# EAGLE design CSR8635-V1.3 (EAGLE 7.2.0)
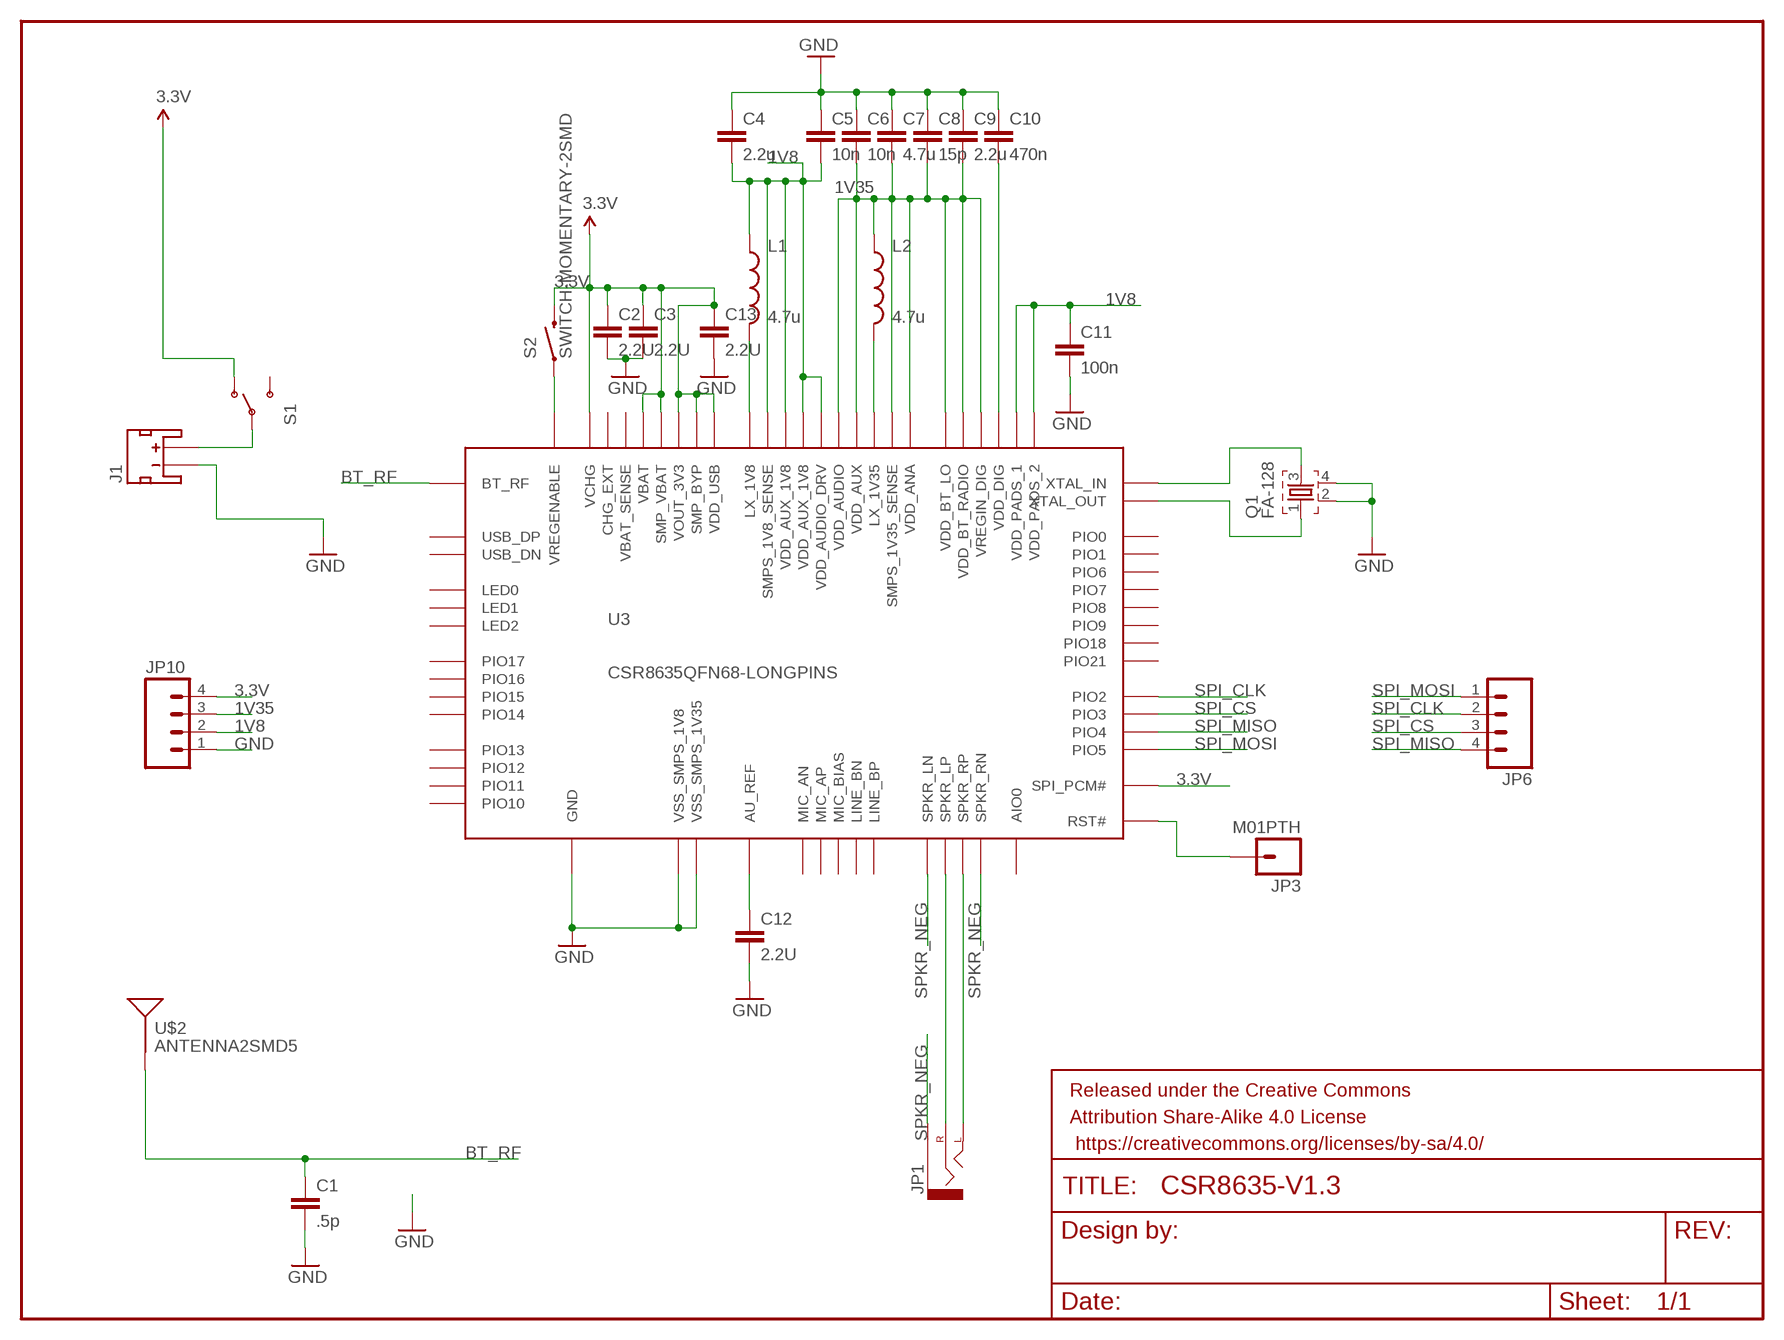
[diagram p0: schematic, sheet 1]

## Parts
C1  .5p  CAP0603-CAP  [0603-CAP]
C2  2.2U  CAP0603-CAP  [0603-CAP]
C3  2.2U  CAP0603-CAP  [0603-CAP]
C4  2.2u  CAP0603-CAP  [0603-CAP]
C5  10n  CAP0603-CAP  [0603-CAP]
C6  10n  CAP0603-CAP  [0603-CAP]
C7  4.7u  CAP0603-CAP  [0603-CAP]
C8  15p  CAP0603-CAP  [0603-CAP]
C9  2.2u  CAP0603-CAP  [0603-CAP]
C10  470n  CAP0603-CAP  [0603-CAP]
C11  100n  CAP0603-CAP  [0603-CAP]
C12  2.2U  CAP0603-CAP  [0603-CAP]
C13  2.2U  CAP0603-CAP  [0603-CAP]
FRAME1  FRAME-LETTER  [CREATIVE_COMMONS]
J1  JST_2MM_MALE  [JST-2-SMD]
JP1  AUDIO-JACKSMD2  [AUDIO-JACK-3.5MM-SMD]
JP3  M01PTH  [1X01]
JP6  M04PTH  [1X04]
JP10  M04PTH  [1X04]
L1  4.7u  INDUCTOR0805  [0805]
L2  4.7u  INDUCTOR0805  [0805]
Q1  FA-128  [FA-128]
S1  SWITCH-SPDTPTH  [SWITCH-SPDT]
S2  SWITCH-MOMENTARY-2SMD  [TACTILE-SWITCH-SMD]
U3  CSR8635QFN68-LONGPINS  [QFN68]
U$2  ANTENNA2SMD5  [ANTENNA-CHIP5]

## Nets
1V8: C4.2 C5.2 C11.1 JP10.2 L1.1 U3.8(VDD_AUDIO_DRV) U3.15(VDD_AUX_1V8) U3.16(VDD_AUX_1V8) U3.33(VDD_PADS_1) U3.53(SMPS_1V8_SENSE) U3.63(VDD_PADS_2)
1V35: C6.2 C7.2 C8.2 C9.2 JP10.3 L2.1 U3.3(VDD_AUDIO) U3.11(VDD_BT_RADIO) U3.13(VDD_BT_LO) U3.14(VDD_AUX) U3.17(VDD_ANA) U3.39(VREGIN_DIG) U3.52(SMPS_1V35_SENSE)
3.3V: C2.1 C3.1 C13.1 JP10.4 S1.1(O) S2.3 U3.29(SPI_PCM#) U3.41(VOUT_3V3) U3.42(VCHG) U3.45(VBAT) U3.48(SMP_VBAT) U3.49(SMP_BYP) U3.54(VDD_USB)
!SPI_PCM: JP3.1 U3.35(RST#)
BT_RF: C1.1 U3.12(BT_RF) U$2.FEED(SIGNAL)
GND: C1.2 C2.2 C3.2 C4.1 C5.1 C6.1 C7.1 C8.1 C9.1 C10.1 C11.2 C12.2 C13.2 J1.1(-) JP10.1 Q1.2 Q1.4 U3.46(VSS_SMPS_1V8) U3.51(VSS_SMPS_1V35) U3.CNTR1(GND) U3.CNTR2(GND) U3.CNTR3(GND) U3.CNTR(GND)
N$1: J1.2(+) S1.2(P)
N$2: JP1.RING(RIGHT) U3.10(SPKR_LP)
N$3: L1.2 U3.47(LX_1V8)
N$4: Q1.3 U3.19(XTAL_IN)
N$5: L2.2 U3.50(LX_1V35)
N$6: C10.2 U3.38(VDD_DIG)
N$7: Q1.1 U3.18(XTAL_OUT)
N$8: JP1.TIP(LEFT) U3.7(SPKR_RP)
N$9: C12.1 U3.1(AU_REF)
N$10: S2.1 U3.40(VREGENABLE)
SPI_CLK: JP6.2 U3.30(PIO2)
SPI_CS: JP6.3 U3.28(PIO3)
SPI_MISO: JP6.4 U3.24(PIO4)
SPI_MOSI: JP6.1 U3.34(PIO5)
SPKR_NEG: JP1.SLEEVE U3.6(SPKR_RN) U3.9(SPKR_LN)
Unconnected: J1.NC1(PAD1) J1.NC2(PAD2) S1.3(S) U3.2(MIC_BIAS) U3.4(LINE_BN) U3.5(LINE_BP) U3.20(AIO0) U3.21(PIO15) U3.22(PIO12) U3.23(PIO14) U3.25(PIO10) U3.26(PIO11) U3.27(PIO16) U3.31(PIO13) U3.32(PIO17) U3.36(LED1) U3.37(LED0) U3.43(CHG_EXT) U3.44(VBAT_SENSE) U3.55(USB_DN) U3.56(USB_DP) U3.57(PIO7) U3.58(PIO9) U3.59(PIO0) U3.60(PIO1) U3.61(PIO8) U3.62(PIO6) U3.64(PIO21) U3.65(PIO18) U3.66(LED2) U3.67(MIC_AN) U3.68(MIC_AP)

## Library data of the parts
C1-C13 = SparkFun-Passives:CAP: Capacitor Standard 0603 ceramic capacitor, and 0.1" leaded capacitor.
FRAME1 = SparkFun-Aesthetics:FRAME-LETTER: Schematic Frame Standard 8.5x11 US Letter frame
J1 = SparkFun-Connectors:JST_2MM_MALE: Mates to single-cell LiPo batteries. CONN-11443 Now with smashable polarity marks!; BTM_NEG: -; BTM_POS: +; PROD_ID: CONN-11443; TOP_NEG: -; TOP_POS: +
JP1 = SparkFun-Connectors:AUDIO-JACK: 3.5mm Audio Jack Simple 3.5mm common PCB mount audio jack. SKU: PRT-08032; PROD_ID: CONN-10353
JP3 = SparkFun-Connectors:M01: Header 1 Standard 1-pin 0.1" header. Use with straight break away headers (SKU : PRT-00116), right angle break away headers (PRT-00553), swiss pins (PRT-00743), machine pins (PRT-00117), and female headers (PRT-00115).
JP6 JP10 = SparkFun-Connectors:M04: Header 4 Standard 4-pin 0.1" header. Use with straight break away headers (SKU : PRT-00116), right angle break away headers (PRT-00553), swiss pins (PRT-00743), machine pins (PRT-00117), and female headers (PRT-00115). Molex polarized connector foot print use with SKU : PRT-08231 with associated crimp pins and housings. 1MM SMD Version SKU: PRT-10208
L1 L2 = SparkFun-Passives:INDUCTOR: Inductors Basic Inductor/Choke - 0603 and 1206. Footprints are not proven and vary greatly between part numbers. SRN6045- 33uH, 20% 1.4A SDR0403-560KL - 56uH, 10%, 500mA RMS/740mA peak
Q1 = crystal:FA-: MHz RANGE CRYSTAL UNIT Source: Epson Toyocom
S1 = SparkFun-Electromechanical:SWITCH-SPDT: SPDT Switch Simple slide switch, Spark Fun Electronics SKU : COM-00102 DPDT SMT slide switch, AYZ0202, SWCH-08179; PROD_ID: SWCH-08261
S2 = SparkFun-Electromechanical:SWITCH-MOMENTARY-2: Various NO switches- pushbuttons, reed, etc; PROD_ID: SWCH-08247
U3 = Ilan:CSR8635
U$2 = SparkFun-RF:ANTENNA2: Chip antenna Single endded antenna. Common with smaller chip antennas. CHIP4 package is the GPS Chip Antenna SKU: GPS-08418. CHIP5 package is 2.4GHz chip antenna SKU: WRL-00144.

## Board
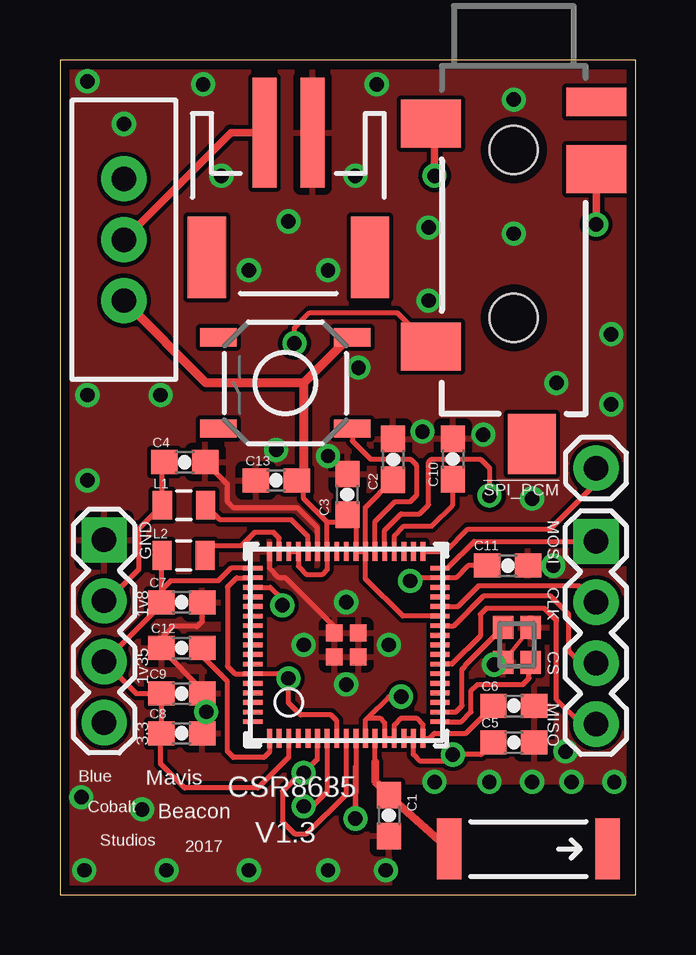
[diagram p1: board, top side]
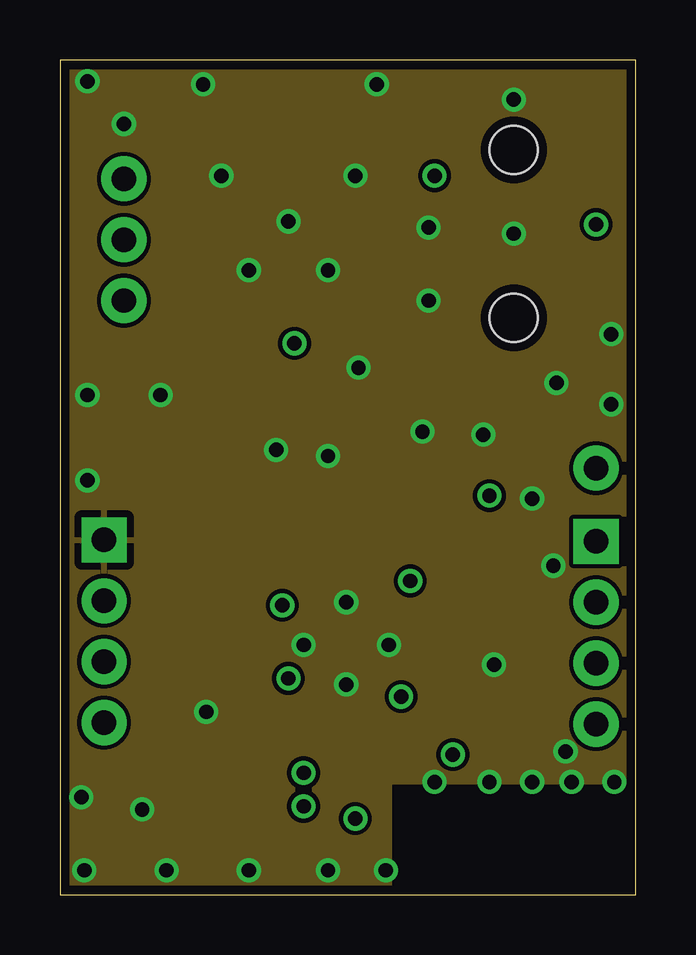
[diagram p2: board, inner layer Route2]
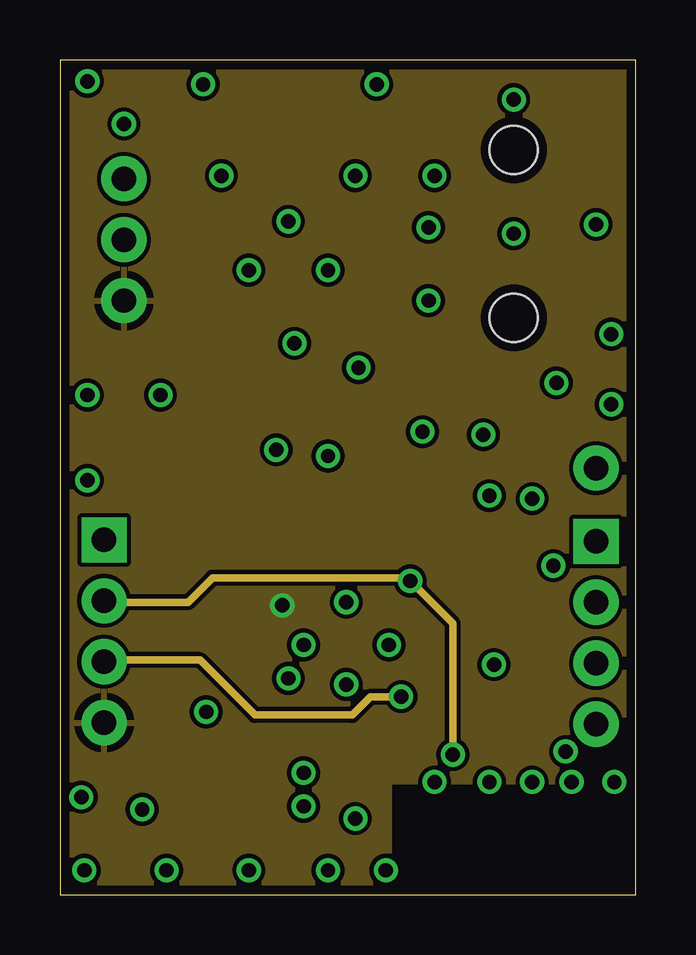
[diagram p3: board, inner layer Route15]
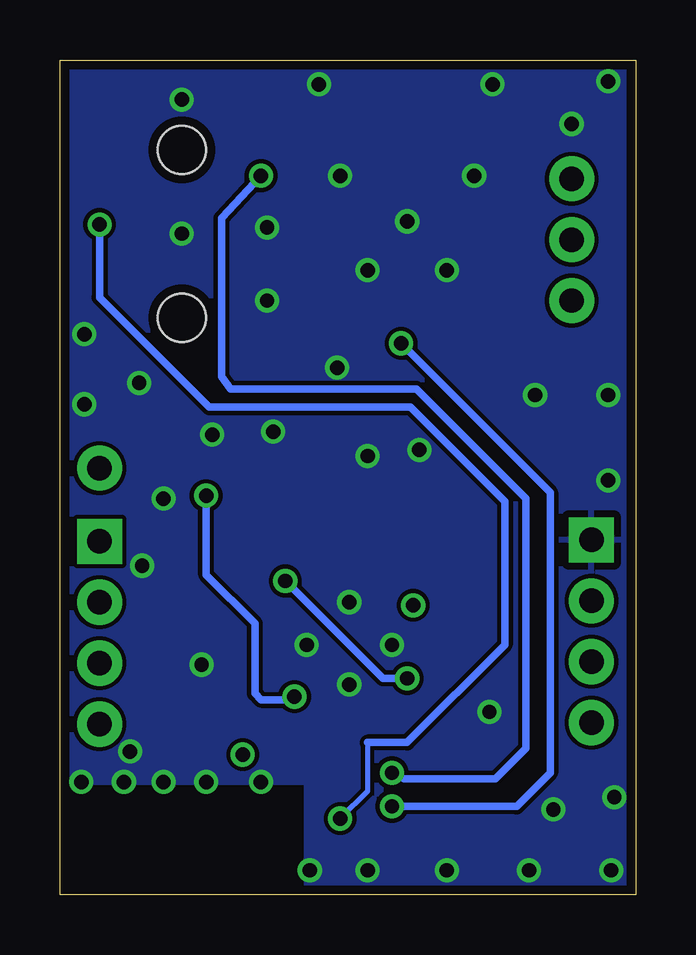
[diagram p4: board, bottom side, seen from below]

Size 24 x 34.8 mm. Coordinates in mm from the lower left corner, seen from the top.
Outline: 0,0 24,0 24,34.8 0,34.8 0,0
Copper layers (1*2*15*16): Top 0.035559375mm / dielectric 0.17018125mm / Route2 0.01778125mm / dielectric 47mil / Route15 0.01778125mm / dielectric 0.17018125mm / Bottom 0.035559375mm
Design rules "OSHPark-4layer *": minimum track width 5mil, minimum drill 10mil, track to track 7mil, track to pad 7mil, pad to pad 7mil, via to via 8mil, smd to smd 7mil, copper to edge 15mil, drill to drill 6mil, minimum pad ring 6mil, minimum via ring 8mil, stop-mask expansion 4mil, vias tented up to drill 25mil, thermal gap 12mil

### Footprints (pad centres in the part's own frame; a part is rotated, then mirrored left to right if it is on the bottom)
0603-CAP = smd 1.1 x 1: 1 -0.85,0; 2 0.85,0
JST-2-SMD = smd 1 x 4.6: 1 -1,-3.7; 2 1,-3.7 | smd 1.6 x 3.4: NC1 -3.4,1.5; NC2 3.4,1.5
AUDIO-JACK-3.5MM-SMD = smd 2 x 2.5: RING 4.3,3.45; SLEEVE 2.4,-3.45; TIP 11.7,-3.45 | smd 1.2 x 2.5: RSH 1.5,3.45 | smd 2.5 x 2: TSH 15.75,0.75 | hole 2: 3.5,0; 10.5,0
1X01 = drill 1.016 pad 1.88: 1 0,0
1X04 = drill 1.016 pad 1.88 square: 1 0,0 | drill 1.016 pad 1.88: 2 2.54,0; 3 5.08,0; 4 7.62,0
0805 = smd 0.8 x 1.2: 1 -0.9,0; 2 0.9,0
FA-128 = smd 0.95 x 0.85: 1 -0.725,-0.575; 2 0.725,-0.575; 3 0.725,0.575; 4 -0.725,0.575
SWITCH-SPDT = drill 1.016 pad 1.88: 1 0,2.54; 2 0,0; 3 0,-2.54
TACTILE-SWITCH-SMD = smd 1.524 x 0.762: 1 -2.794,1.905; 2 2.794,1.905; 3 -2.794,-1.905; 4 2.794,-1.905
QFN68 = smd 0.8 x 0.2: 1 -3.9,3.2; 2 -3.9,2.8; 3 -3.9,2.4; 4 -3.9,2; 5 -3.9,1.6; 6 -3.9,1.2; 7 -3.9,0.8; 8 -3.9,0.4; 9 -3.9,0; 10 -3.9,-0.4; 11 -3.9,-0.8; 12 -3.9,-1.2; 13 -3.9,-1.6; 14 -3.9,-2; 15 -3.9,-2.4; 16 -3.9,-2.8; 17 -3.9,-3.2; 35 3.9,-3.2; 36 3.9,-2.8; 37 3.9,-2.4; 38 3.9,-2; 39 3.9,-1.6; 40 3.9,-1.2; 41 3.9,-0.8; 42 3.9,-0.4; 43 3.9,0; 44 3.9,0.4; 45 3.9,0.8; 46 3.9,1.2; 47 3.9,1.6; 48 3.9,2; 49 3.9,2.4; 50 3.9,2.8; 51 3.9,3.2 | smd 0.2 x 0.8: 18 -3.2,-3.9; 19 -2.8,-3.9; 20 -2.4,-3.9; 21 -2,-3.9; 22 -1.6,-3.9; 23 -1.2,-3.9; 24 -0.8,-3.9; 25 -0.4,-3.9; 26 0,-3.9; 27 0.4,-3.9; 28 0.8,-3.9; 29 1.2,-3.9; 30 1.6,-3.9; 31 2,-3.9; 32 2.4,-3.9; 33 2.8,-3.9; 34 3.2,-3.9; 52 3.2,3.9; 53 2.8,3.9; 54 2.4,3.9; 55 2,3.9; 56 1.6,3.9; 57 1.2,3.9; 58 0.8,3.9; 59 0.4,3.9; 60 0,3.9; 61 -0.4,3.9; 62 -0.8,3.9; 63 -1.2,3.9; 64 -1.6,3.9; 65 -2,3.9; 66 -2.4,3.9; 67 -2.8,3.9; 68 -3.2,3.9 | smd 0.7 x 0.7: CNTR 0.5,0.5; CNTR1 0.5,-0.5; CNTR2 -0.5,-0.5; CNTR3 -0.5,0.5
ANTENNA-CHIP5 = smd 1.016 x 2.54: FEED -3.302,0; NC 3.302,0

### Placement (x,y rotation side)
C1  13.72,3.3 270 top
C2  13.89,18.15 90 top
C3  11.99,16.69 90 top
C4  5.21,18.03 180 top
C5  18.92,6.35 180 top
C6  18.92,7.87 180 top
C7  5.08,12.19 180 top
C8  5.08,6.73 180 top
C9  5.08,8.38 180 top
C10  16.38,18.16 270 top
C11  18.67,13.72 0 top
C12  5.08,10.29 180 top
C13  9.02,17.27 180 top
FRAME1  116.59,79.63 0 top  (outside the outline)
J1  9.53,28.07 180 top
JP1  18.92,34.54 270 top
JP3  22.35,17.78 0 top
JP6  22.35,14.73 270 top
JP10  1.84,14.79 270 top
L1  5.17,16.23 0 top
L2  5.16,14.15 0 top
Q1  19.05,10.41 90 top
S1  2.67,27.3 180 top
S2  9.4,21.34 180 top
U3  11.94,10.41 90 top
U$2  19.53,1.91 0 top

### Tracks (layer width: path | path; a pad name or v marks a point on that pad's centre or on a via)
1V8  (via drill 0.6)
  Top 0.203: C4.2 4.27,17.95 L1.1 3.3,15.27 3.3,13.59 1.97,12.25 JP10.2 | 17.91,6.6 C5.2 17.57,5.84 v16.38,5.84 16.13,5.59 14.99,5.59 14.73,5.84 U3.16 U3.15 | v14.61,13.08 14.74,13.21 U3.33 16.51,13.21 17.02,13.72 C11.1 | U3.53 7.37,13.21 6.98,12.83 6.98,9.53 7.3,9.21 U3.63 9.33,9.21 v9.53,9.02 9.53,8 10.03,7.49 11.3,7.49 11.54,7.26 U3.8
  Route15 0.305: v16.38,5.84 16.38,11.3 v14.61,13.08 14.47,13.21 6.36,13.21 5.33,12.19 1.9,12.19 JP10.2
  Bottom 0.305: v14.61,13.08 10.54,9.02 v9.53,9.02
1V35  (via drill 0.6)
  Top 0.203: U3.3 9.54,5.73 8.26,4.45 5.21,4.45 4.19,5.46 4.19,6.69 C8.2 C9.2 3.17,8.38 JP10.3 4.23,12.1 C7.2 4.23,12.7 | 4.23,12.7 4.23,14.12 L2.1 | 4.23,12.7 4.61,13.08 6.6,13.08 7.14,13.61 U3.52 | C6.2 16.93,6.73 15.62,6.73 15.4,6.51 U3.17 15.14,7.09 14.86,7.37 14.22,7.37 13.94,7.08 U3.14 U3.13 13.54,7.16 13.34,7.37 12.83,7.37 | U3.11 12.74,7.28 12.83,7.37 | v17.91,16.64 17.91,17.78 17.53,18.16 15.49,18.16 15.37,18.03 15.37,16.26 14.99,15.88 14.22,15.88 13.54,15.19 U3.39 | 12.83,7.37 13.72,8.26 v14.22,8.26
  Route15 0.305: 2.41,9.14 JP10.3 1.91,9.78 5.84,9.78 8.13,7.49 12.19,7.49 12.95,8.26 v14.22,8.26
  Bottom 0.305: v17.91,16.64 17.91,13.33 15.88,11.3 15.88,8.38 15.62,8.13 14.35,8.13 v14.22,8.26
3.3V  (via drill 0.6)
  Top 0.203: U3.49 U3.48 9.94,13.68 10.29,13.33 10.92,13.33 11.14,13.55 U3.45 11.14,15.53 | U3.54 8.78,12.81 9.27,12.32 v9.27,12.06 | U3.29 14.29,11.61 12.74,13.17 U3.41 | 11.14,15.53 10.16,16.51 10.16,16.98 C13.1 | 11.14,15.53 11.68,15.53 C3.1 12.34,15.49 U3.42 U3.41 | U3.41 12.74,16.14 C2.1
  Top 0.381: S2.3 12.07,23.24 10.16,21.34 | 10.16,21.34 6.1,21.34 S1.1 | 10.16,21.34 10.16,17.56 C13.1
  pour Route15: 0,34.8 24,34.8 24,4.7 13.72,4.7 13.72,0 0,0
!SPI_PCM
  Top 0.203: U3.35 16.09,14.31 17.02,15.24 20.45,15.24 22.35,17.15 JP3.1
BT_RF
  Top 0.203: 13.14,5.53 U3.12
  Top 0.33: 13.14,5.53 13.14,4.73 C1.1 U$2.FEED
GND  (via drill 0.6)
  Top 0.178: Q1.4 Q1.2
  Top 0.203: U3.46 10.74,15.3 9.91,16.13 7.24,16.13 6.98,16.38 6.98,17.11 C4.1 | U3.51 8.74,13.61 9.14,13.21 9.4,13.21 11.44,11.17 U3.CNTR | C7.1 5.93,11.39 5.71,11.18 4.7,11.18 4.23,10.71 C12.2 4.23,10.25 5.93,8.55 C9.1 | 6.1,8.22 v6.1,7.62 6.1,6.9 C8.1 | C11.2 v20.57,13.72
  Top 0.305: 6.1,8.22 C9.1
  other vias: 10.16,10.41 13.72,10.41 19.68,16.51 7.87,1.02 4.45,1.02 1.02,1.02 0.89,4.06 3.43,3.56 21.08,5.97 11.18,1.02 1.14,20.83 4.19,20.83 22.99,20.45 22.99,23.37 18.92,27.56 18.92,33.15 13.21,33.78 5.97,33.78 1.14,33.91 9.53,28.07 20.7,21.34 7.87,26.04 11.18,26.04 12.32,29.97 6.73,29.97 2.67,32.13 15.37,24.77 15.37,27.81 1.14,17.27 18.1,9.59 12.45,21.97 23.11,4.7 21.34,4.7 19.68,4.7 17.91,4.7 13.59,1.02 15.62,4.7 11.94,12.19 11.94,8.76 9.02,18.54 11.18,18.29 17.65,19.18 15.11,19.3
  pour Route2: 0,34.8 24,34.8 24,4.7 13.72,4.7 13.72,0 0,0
  pour Bottom: 0,34.8 24,34.8 24,4.7 13.72,4.7 13.72,0 0,0
  pour Top: 0,34.8 24,34.8 24,4.7 13.72,4.7 13.72,0 0,0
N$1
  Top 0.305: S1.2 7.13,31.77 J1.2
N$2  (via drill 0.6)
  Top 0.203: 12.32,5.33 v12.32,3.18 12.34,5.23 U3.10
  Top 0.305: JP1.RING 22.37,27.96 v22.35,27.94
  Bottom 0.203: 11.18,6.35 11.18,4.32 v12.32,3.18
  Bottom 0.305: v22.35,27.94 22.35,24.89 17.78,20.32 9.4,20.32 5.46,16.38 5.46,10.41 9.53,6.35 11.18,6.35
N$3
  Top 0.203: U3.47 10.34,14.94 9.65,15.62 6.68,15.62 L1.2
N$4
  Top 0.203: U3.19 16.5,7.61 16.76,7.87 16.76,9.4 16.89,9.53 16.89,9.56 Q1.3
N$5
  Top 0.203: L2.2 6.06,14.56 7.58,14.56 8.13,15.11 8.89,15.11 9.14,14.87 U3.50
N$6
  Top 0.203: U3.38 13.94,14.95 14.35,15.37 15.49,15.37 16.38,16.26 C10.2
N$7
  Top 0.203: U3.18 16.74,7.21 17.14,7.62 17.14,8.51 17.4,8.76 19.3,8.76 19.56,9.02 19.56,9.62 Q1.1
N$8  (via drill 0.6)
  Top 0.203: U3.7 11.14,4.28 10.54,3.68 v10.16,3.68 | v9.78,22.99 9.78,23.62 10.41,24.26 14.06,24.26 JP1.TIP
  Bottom 0.305: v9.78,22.99 3.56,16.76 3.56,5.08 4.95,3.68 v10.16,3.68
N$9
  Top 0.203: U3.1 8.74,5.94 8.51,5.71 7.24,5.71 6.98,5.97 6.98,8.89 5.93,9.95 C12.1
N$10
  Top 0.203: U3.40 13.14,15.55 13.97,16.38 14.61,16.38 14.86,16.64 14.86,17.91 14.61,18.16 12.95,18.16 12.19,18.92 S2.1
SPI_CLK
  Top 0.203: U3.30 16.59,12.01 17.46,12.89 21.65,12.89 JP6.2
SPI_CS
  Top 0.203: JP6.3 21.72,9.65 21.21,10.16 21.21,11.68 20.45,12.45 17.65,12.45 16.42,11.21 U3.28
SPI_MISO
  Top 0.203: JP6.4 21.72,7.11 20.7,8.13 20.7,11.43 20.19,11.94 17.78,11.94 17.53,11.68 17.53,10.79 16.34,9.61 U3.24
SPI_MOSI
  Top 0.203: U3.34 16.15,13.61 17.27,14.73 JP6.1
SPKR_NEG  (via drill 0.6)
  Top 0.203: U3.6 10.74,5.66 v10.16,5.08 10.03,5.08 9.27,4.32 9.27,3.05 9.78,2.54 10.29,2.54 11.94,4.19 U3.9
  Top 0.305: JP1.SLEEVE 15.62,32 v15.62,29.97
  Bottom 0.305: v10.16,5.08 9.65,4.83 5.84,4.83 4.57,6.1 4.57,16.51 9.14,21.08 16.89,21.08 17.27,21.59 17.27,28.19 v15.62,29.97

### Text on the board
tPlace: !SPI_PCM | MOSI | GND | CLK | 1v8 | CS | 1v35 | MISO | 3.3 | Blue | Mavis | CSR8635 | Cobalt | Beacon | Studios | 2017 | V1.3